# EasyEDA schematic SCH_12V-DC-Distribute_2025-02-16 (1).json
TITLE: Sheet_1; REV: 1.0; Date: 2025-02-15; Sheet: 1/1; Drawn By: ifazfachrul; Company: Your Company
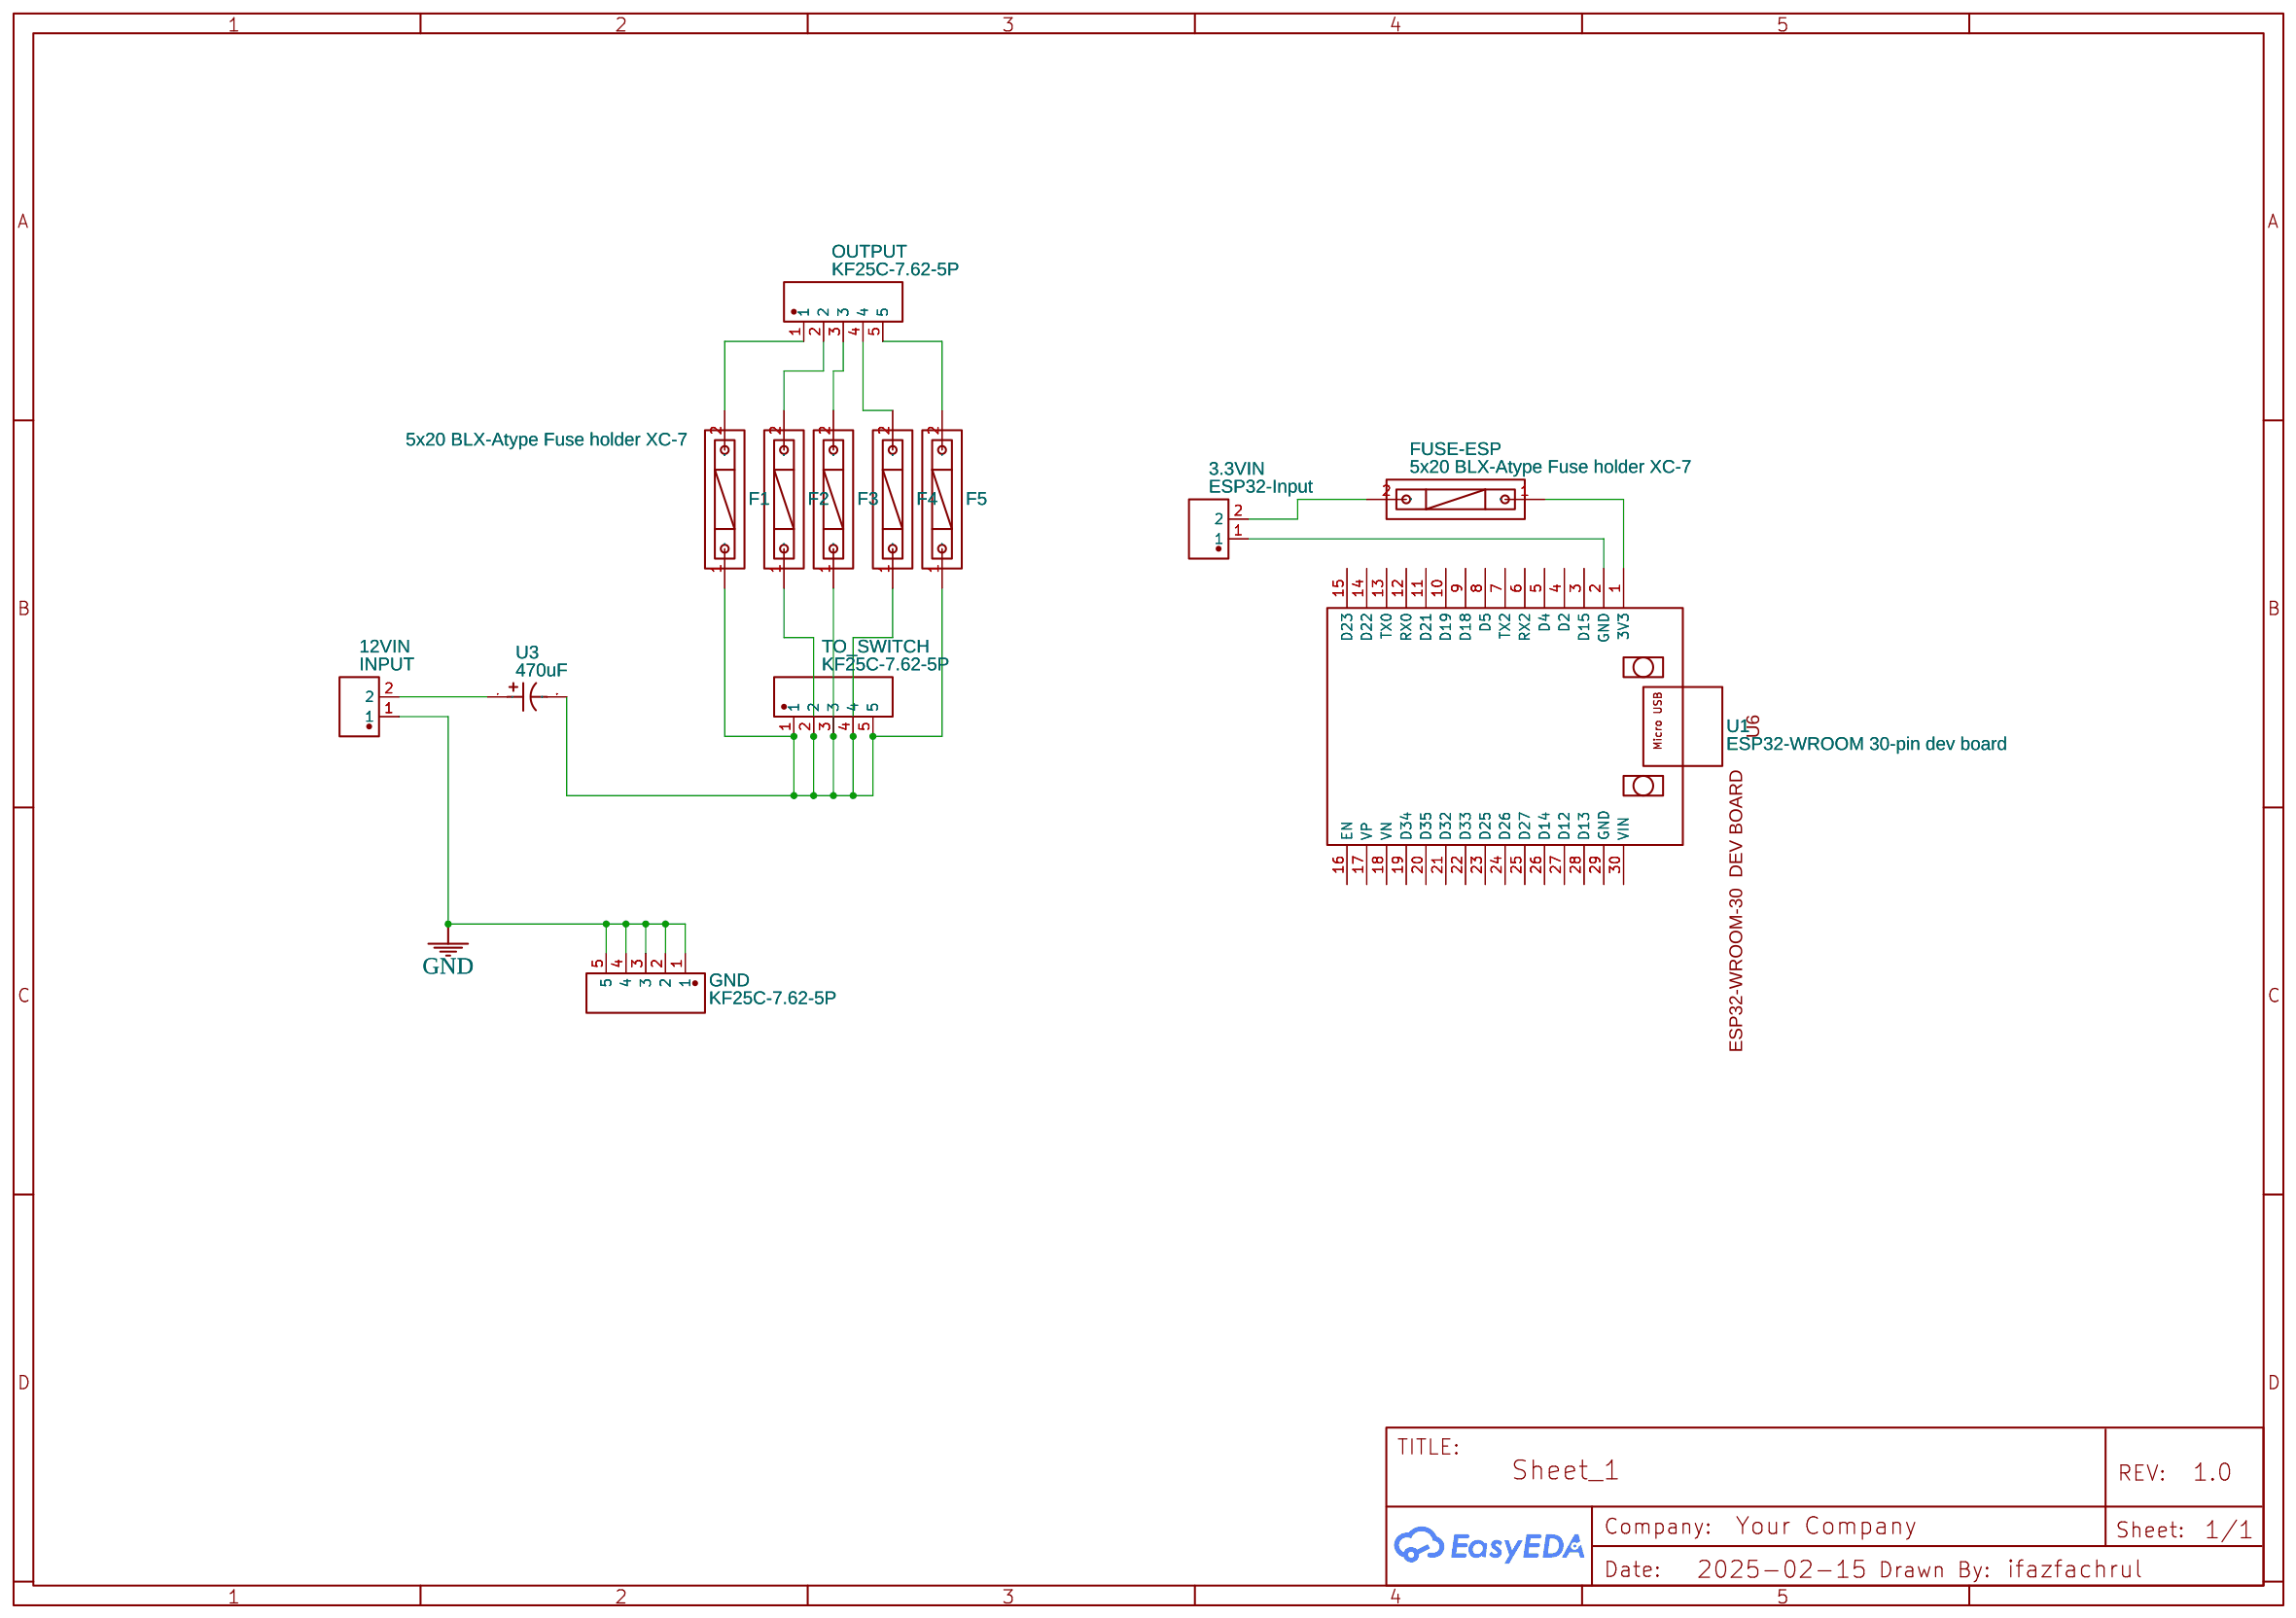
[diagram p0: schematic sheet]

## Parts
3.3VIN  ESP32-Input  [CONN-TH_KF25H-7.62-2P]
12VIN  INPUT  [CONN-TH_KF25H-7.62-2P]
F1  5x20 BLX-Atype Fuse holder XC-7  [FUSE-TH_L22.6-W9.0]
F2  5x20 BLX-Atype Fuse holder XC-7  [FUSE-TH_L22.6-W9.0]
F3  5x20 BLX-Atype Fuse holder XC-7  [FUSE-TH_L22.6-W9.0]
F4  5x20 BLX-Atype Fuse holder XC-7  [FUSE-TH_L22.6-W9.0]
F5  5x20 BLX-Atype Fuse holder XC-7  [FUSE-TH_L22.6-W9.0]
FUSE-ESP  5x20 BLX-Atype Fuse holder XC-7  [FUSE-TH_L22.6-W9.0]
GND  KF25C-7.62-5P  [CONN-TH_KF25C-7.62-5P]
OUTPUT  KF25C-7.62-5P  [CONN-TH_KF25C-7.62-5P]
TO_SWITCH  KF25C-7.62-5P  [CONN-TH_KF25C-7.62-5P]
U1  ESP32-WROOM 30-pin dev board  [ESP32-WROOM-30-DEVBOARD]
U3  470uF  [CAP-SMD_BD8.0-L8.3-W8.3-LS8.9-FD]

## Library data of the parts
3.3VIN 12VIN = KF25H-7.62-2P: Contributor: LCSC; Supplier: LCSC; Supplier Part: C707373; Manufacturer: KEFA(科发); JLCPCB Part Class: Extended Part
F1-F5 FUSE-ESP = 5x20 BLX-Atype Fuse holder XC-7: Supplier: LCSC; Manufacturer Part: 5x20 BLX-A型 保险丝支架 XC-7; Manufacturer: xcfuse(旭程); Supplier Part: C3131; JLCPCB Part Class: Extended Part
GND OUTPUT TO_SWITCH = KF25C-7.62-5P: Contributor: LCSC; Supplier: LCSC; Supplier Part: C707364; Manufacturer: KEFA(科发); JLCPCB Part Class: Extended Part
U1 = ESP32-WROOM 30-pin dev board: Contributor: viana7339
U3 = VT470UF16V167RV0135: Supplier: LCSC; Supplier Part: C5246586; Manufacturer: KNSCHA(科尼盛); JLCPCB Part Class: Extended Part; Contributor: lcsc

## Nets
GND: 12VIN.1 GND.1 GND.2 GND.3 GND.4 GND.5
Net-(3.3VIN-1): 3.3VIN.1 U1.2(GND)
Net-(3.3VIN-2): 3.3VIN.2 FUSE-ESP.2
Net-(12VIN-2): 12VIN.2 U3.1
Net-(F1-1): F1.1 F2.1 F3.1 F4.1 F5.1 TO_SWITCH.1 TO_SWITCH.2 TO_SWITCH.3 TO_SWITCH.4 TO_SWITCH.5 U3.2
Net-(F1-2): F1.2 OUTPUT.1
Net-(F2-2): F2.2 OUTPUT.2
Net-(F3-2): F3.2 OUTPUT.3
Net-(F4-2): F4.2 OUTPUT.4
Net-(F5-2): F5.2 OUTPUT.5
Net-(FUSE-ESP-1): FUSE-ESP.1 U1.1(3V3)

Not connected (* = marked no-connect by the designer): U1 3(D15) 4(D2) 5(D4) 6(RX2) 7(TX2) 8(D5) 9(D18) 10(D19) 11(D21) 12(RX0) 13(TX0) 14(D22) 15(D23) 16(EN) 17(VP) 18(VN) 19(D34) 20(D35) 21(D32) 22(D33) 23(D25) 24(D26) 25(D27) 26(D14) 27(D12) 28(D13) 29(GND) 30(VIN)
